# Altium project POC_Marvin.PrjPcb
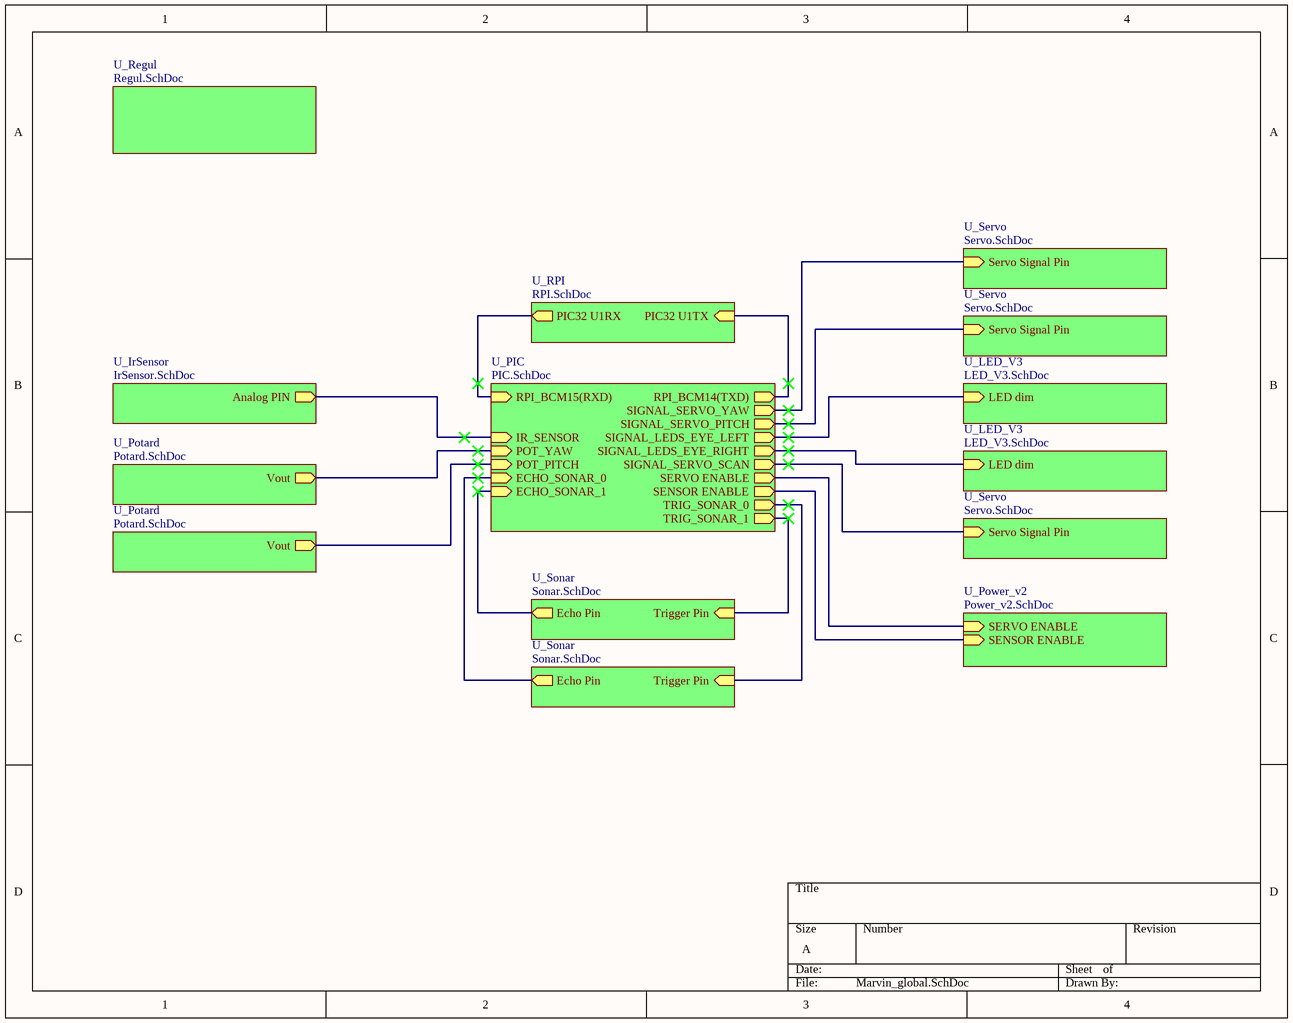
[diagram p0: Marvin_global.SchDoc]
10 sheets, 41 parts. Net scope: hierarchical (ports join the sheet entries above them; power ports are global).
Board files: Marvin_PCB.PcbDoc, Marvin_PCB_V2.PcbDoc, Marvin_PCB_v3.PcbDoc
Sheets:
  Marvin_global.SchDoc
    U_IrSensor = IrSensor.SchDoc
    U_LED_V3 = LED_V3.SchDoc
    U_LED_V3 = LED_V3.SchDoc
    U_Potard = Potard.SchDoc
    U_Potard = Potard.SchDoc
    U_Power_v2 = Power_v2.SchDoc
    U_Regul = Regul.SchDoc
    U_RPI = RPI.SchDoc
    U_Servo = Servo.SchDoc
    U_Sonar = Sonar.SchDoc
    U_Servo = Servo.SchDoc
    U_Servo = Servo.SchDoc
    U_Sonar = Sonar.SchDoc
    U_PIC = PIC.SchDoc

## Sheet Marvin_global.SchDoc
size A

### Sub-sheets
U_IrSensor = IrSensor.SchDoc: Analog PIN (out)
U_LED_V3 = LED_V3.SchDoc: LED dim (in)
U_LED_V3 = LED_V3.SchDoc: LED dim (in)
U_PIC = PIC.SchDoc: RPI_BCM15(RXD) (in), RPI_BCM14(TXD) (out), SIGNAL_SERVO_YAW (out), SIGNAL_SERVO_PITCH (out), SIGNAL_LEDS_EYE_LEFT (out), SIGNAL_LEDS_EYE_RIGHT (out), SIGNAL_SERVO_SCAN (out), TRIG_SONAR_0 (out), TRIG_SONAR_1 (out), ECHO_SONAR_0 (in), ECHO_SONAR_1 (in), IR_SENSOR (in), POT_YAW (in), POT_PITCH (in), SERVO ENABLE (out), SENSOR ENABLE (out)
U_Potard = Potard.SchDoc: Vout (out)
U_Potard = Potard.SchDoc: Vout (out)
U_Power_v2 = Power_v2.SchDoc: SERVO ENABLE (in), SENSOR ENABLE (in)
U_Regul = Regul.SchDoc: no entries
U_RPI = RPI.SchDoc: PIC32 U1TX (in), PIC32 U1RX (out)
U_Servo = Servo.SchDoc: Servo Signal Pin (in)
U_Servo = Servo.SchDoc: Servo Signal Pin (in)
U_Servo = Servo.SchDoc: Servo Signal Pin (in)
U_Sonar = Sonar.SchDoc: Trigger Pin (in), Echo Pin (out)
U_Sonar = Sonar.SchDoc: Trigger Pin (in), Echo Pin (out)

### Nets
NetJ1_3: sheet U_IrSensor/Analog PIN, sheet U_PIC/IR_SENSOR
NetJ2_U_Potard1_3: sheet U_Potard/Vout, sheet U_PIC/POT_PITCH
NetJ2_U_Potard2_3: sheet U_Potard/Vout, sheet U_PIC/POT_YAW
NetJ4_1: sheet U_RPI/PIC32 U1TX, sheet U_PIC/RPI_BCM14(TXD)
NetJ4_2: sheet U_RPI/PIC32 U1RX, sheet U_PIC/RPI_BCM15(RXD)
NetJ5_U_Servo1_3: sheet U_Servo/Servo Signal Pin, sheet U_PIC/SIGNAL_SERVO_SCAN
NetJ5_U_Servo2_3: sheet U_Servo/Servo Signal Pin, sheet U_PIC/SIGNAL_SERVO_PITCH
NetJ5_U_Servo3_3: sheet U_Servo/Servo Signal Pin, sheet U_PIC/SIGNAL_SERVO_YAW
NetJ6_U_Sonar1_2: sheet U_Sonar/Trigger Pin, sheet U_PIC/TRIG_SONAR_1
NetJ6_U_Sonar1_3: sheet U_Sonar/Echo Pin, sheet U_PIC/ECHO_SONAR_1
NetJ6_U_Sonar2_2: sheet U_Sonar/Trigger Pin, sheet U_PIC/TRIG_SONAR_0
NetJ6_U_Sonar2_3: sheet U_Sonar/Echo Pin, sheet U_PIC/ECHO_SONAR_0
NetJ7_U_LED_V31_3: sheet U_LED_V3/LED dim, sheet U_PIC/SIGNAL_LEDS_EYE_RIGHT
NetJ7_U_LED_V32_3: sheet U_LED_V3/LED dim, sheet U_PIC/SIGNAL_LEDS_EYE_LEFT
NetQ1_2: sheet U_Power_v2/SENSOR ENABLE, sheet U_PIC/SENSOR ENABLE
NetQ2_1: sheet U_Power_v2/SERVO ENABLE, sheet U_PIC/SERVO ENABLE

## Sheet IrSensor.SchDoc
size A4; Organization: Altium Limited; Address1: L3, 12a Rodborough Rd; Address2: Frenchs Forest; Address3: NSW; Address4: Australia 2086
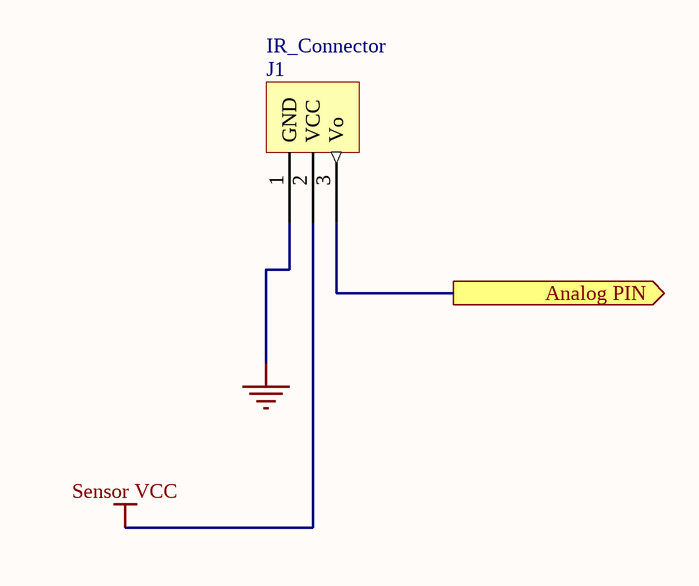
[diagram p1: IrSensor.SchDoc]

### Parts
J1  IR_Connector  [IR SENSOR CONNECTOR]

### Ports
Analog PIN (out)

### Nets
GND: J1.1(GND)
Sensor VCC: J1.2(VCC)
NetJ1_3: J1.3(Vo) ; port Analog PIN

### Notes on the sheet
- Title
- Size:
- Date:
- A4
- Number:
- Time:
- Revision:
- Sheet
- of
- File:

### Library data of the parts
J1 = IR_Connector: Female Embase 3 contacts; fournisseur: Farnell; reffournisseur: 1845931; fabricant: TE CONNECTIVITY / AMP; reffabricant: 5-534237-1

## Sheet LED_V3.SchDoc
size A
Used 2 times, as channels U_LED_V3, U_LED_V3. Parts and nets are listed once, with the designators drawn on the sheet.
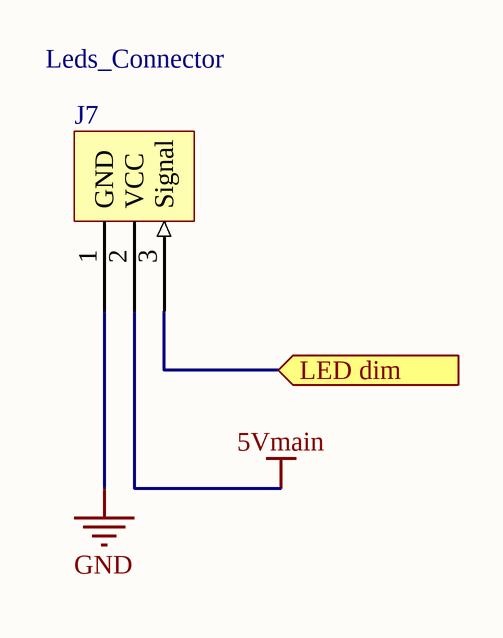
[diagram p2: LED_V3.SchDoc]

### Parts
J7  Leds_Connector  [LEDS CONNECTOR]

### Ports
LED dim (in)

### Nets
5Vmain: J7.2(VCC)
GND: J7.1(GND)
LED dim: J7.3(Signal) ; port LED dim

### Channels
U_LED_V3: designators end in _U_LED_V32; ports LED dim=NetJ7_U_LED_V32_3
U_LED_V3: designators end in _U_LED_V31; ports LED dim=NetJ7_U_LED_V31_3

### Library data of the parts
J7 = Leds_Connector: Female Embase 3 contacts; fournisseur: Farnell; reffournisseur: 1845931; fabricant: TE CONNECTIVITY / AMP; reffabricant: 5-534237-1

## Sheet Potard.SchDoc
size A
Used 2 times, as channels U_Potard, U_Potard. Parts and nets are listed once, with the designators drawn on the sheet.
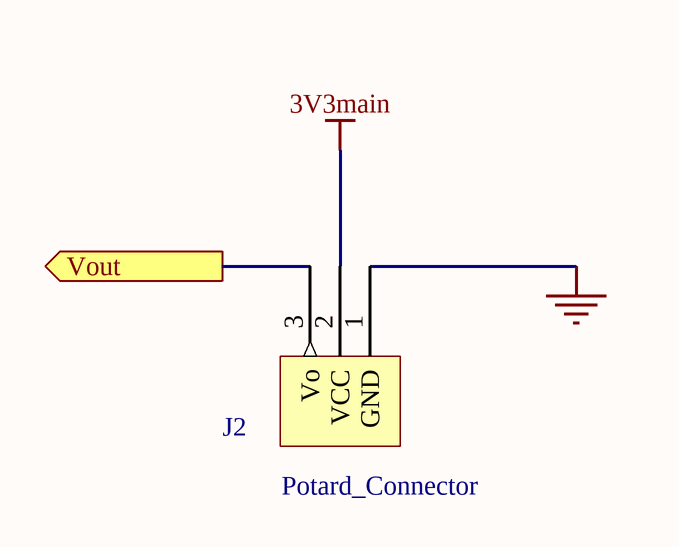
[diagram p3: Potard.SchDoc]

### Parts
J2  Potard_Connector  [POTARD CONNECTOR]

### Ports
Vout (out)

### Nets
3V3main: J2.2(VCC)
GND: J2.1(GND)
Vout: J2.3(Vo) ; port Vout

### Channels
U_Potard: designators end in _U_Potard2; ports Vout=NetJ2_U_Potard2_3
U_Potard: designators end in _U_Potard1; ports Vout=NetJ2_U_Potard1_3

### Library data of the parts
J2 = Potard_Connector: Female Embase 3 contacts; fournisseur: Farnell; reffournisseur: 1845931; fabricant: TE CONNECTIVITY / AMP; reffabricant: 5-534237-1

## Sheet Power_v2.SchDoc
size A
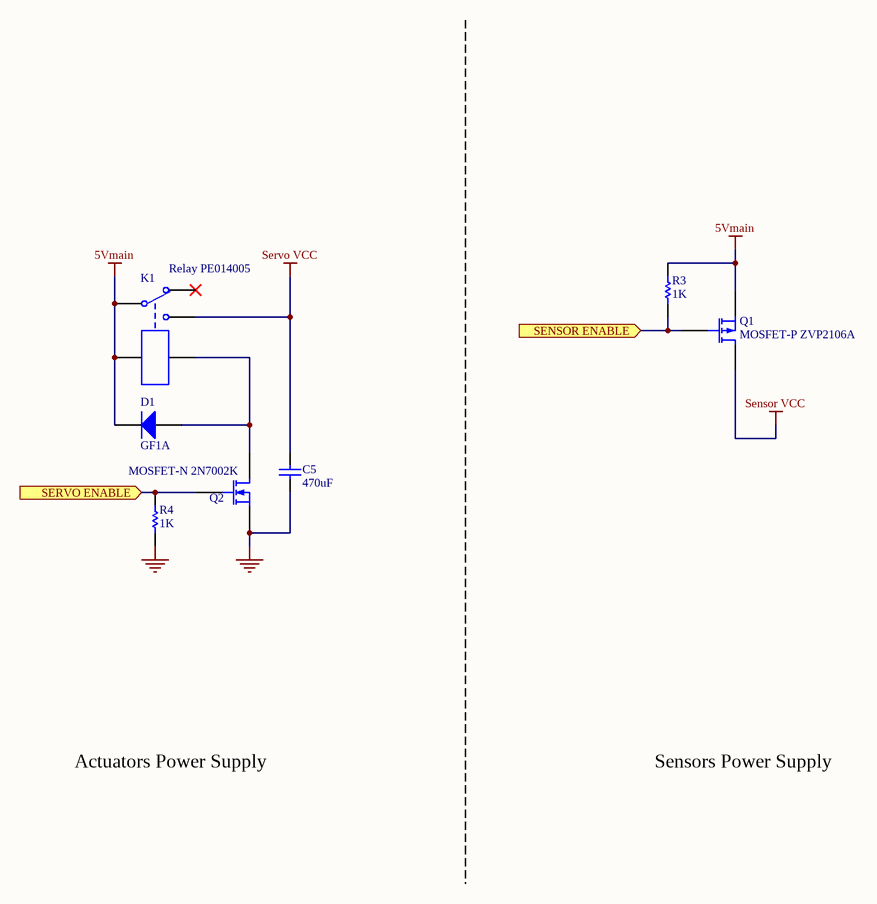
[diagram p4: Power_v2.SchDoc]

### Parts
C5  470uF  [CONDO_D_10mm]
D1  GF1A  [SMA/DO-214AC_21]
K1  Relay PE014005  [PE014005]
Q1  MOSFET-P ZVP2106A  [SOT23]
Q2  MOSFET-N 2N7002K  [SOT23]
R3  1K  [1608 / 0603]
R4  1K  [1608 / 0603]

### Ports
SENSOR ENABLE (in), SERVO ENABLE (in)

### Nets
5Vmain: D1.2(K) K1.12 K1.A2 Q1.3(S) R3.2
GND: C5.1 Q2.2(G) R4.1
Sensor VCC: Q1.1(D)
Servo VCC: C5.2 K1.11
NetD1_1: D1.1(A) K1.A1 Q2.3(S)
NetQ1_2: Q1.2(G) R3.1 ; port SENSOR ENABLE
NetQ2_1: Q2.1(D) R4.2 ; port SERVO ENABLE

Not connected (* = marked no-connect by the designer): K1 14*

### Notes on the sheet
- Actuators Power Supply
- Sensors Power Supply

### Library data of the parts
C5 = Cap: Capacitor; fabricant: Panasonic; fournisseur: Farnell; reffabricant: ECA-1EHG471; reffournisseur: 9692843; Published: 8-Jun-2000; LatestRevisionDate: 17-Jul-2002; LatestRevisionNote: Re-released for DXP Platform.; PackageReference: RAD-0.3; Publisher: Altium Limited; PackageDescription: Radial Cap, Thru-Hole; 2 Leads; 0.3 in Pin Spacing
D1 = Diode: Default Diode; fournisseur: Farnell; reffournisseur: 9549560; fabricant: VISHAY; reffabricant: GF1A-E3/67A; Published: 8-Jun-2000; LatestRevisionDate: 17-Jul-2002; LatestRevisionNote: Re-released for DXP Platform.; PackageVersion: Sep-1996; PackageReference: SMC; Publisher: Altium Limited; PackageDescription: DO-214-AB/SMC; 2 C-Bend Leads; Body 7.9 x 5.9 mm, inc. leads (LxW); Code_JEDEC: DO-214-AB
K1 = Relay-SPDT: Relay; fournisseur: Farnell; reffournisseur: 1175088; fabricant: TE CONNECTIVITY / SCHRACK; Published: 24-Mar-1999; LatestRevisionDate: 17-Jul-2002; LatestRevisionNote: Re-released for DXP Platform.; PackageReference: MODULE5B; Publisher: Altium Limited; reffabricant: PE014005
Q1 = MOSFET-P: P-Channel MOSFET; fournisseur: Farnell; reffournisseur: 9525505; fabricant: DIODES INC; Published: 8-Jun-2000; LatestRevisionDate: 17-Jul-2002; LatestRevisionNote: Re-released for DXP Platform.; PackageVersion: 1995/1996; PackageReference: E3; Publisher: Altium Limited; PackageDescription: TO, Flat Index; 3 In-Line, Axial Leads; Body Dia. 4.6mm; Lead Dia. 0.5 mm (max); reffabricant: ZVP2106A
Q2 = MOSFET-N: N-Channel MOSFET; fournisseur: Farnell; reffournisseur: 2453382; fabricant: FAIRCHILD SEMICONDUCTOR; Published: 8-Jun-2000; LatestRevisionDate: 17-Jul-2002; LatestRevisionNote: Re-released for DXP Platform.; PackageVersion: 1995/1996; PackageReference: E3; Publisher: Altium Limited; PackageDescription: TO, Flat Index; 3 In-Line, Axial Leads; Body Dia. 4.6mm; Lead Dia. 0.5 mm (max); reffabricant: 2N7002K
R3 R4 = Res1: Resistor; Published: 8-Jun-2000; LatestRevisionDate: 17-Jul-2002; LatestRevisionNote: Re-released for DXP Platform.; PackageReference: AXIAL-0.3; Publisher: Altium Limited; PackageDescription: Axial Device, Thru-Hole; 2 Leads; 0.3 in Pin Spacing; Value: 1K

## Sheet Regul.SchDoc
size A
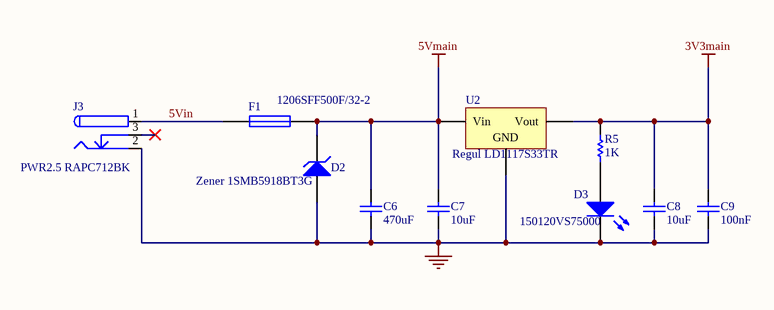
[diagram p5: Regul.SchDoc]

### Parts
C6  470uF  [CONDO_D_10mm]
C7  10uF  [CONDO_D_5MM]
C8  10uF  [CONDO_D_5MM]
C9  100nF  [1608 / 0603]
D2  Zener 1SMB5918BT3G  [DIODE ZENER]
D3  150120VS75000  [3216 / 1206]
F1  1206SFF500F/32-2  [3216 / 1206]
J3  PWR2.5 RAPC712BK  [RAPC712BK]
R5  1K  [1608 / 0603]
U2  Regul LD1117S33TR  [SOT-223]

### Nets
3V3main: C8.2 C9.2 R5.2 U2.3(Vout)
5Vmain: C6.2 C7.2 D2.2(K) F1.2 U2.1(Vin)
GND: C6.1 C7.1 C8.1 C9.1 D2.1(A) D3.2(K) J3.2 U2.2(GND)
5Vin: F1.1 J3.1
NetD3_1: D3.1(A) R5.1

Not connected (* = marked no-connect by the designer): J3 3*

### Library data of the parts
C6 = Cap: Capacitor; Value: ECA-1EHG471; fabricant: Panasonic; fournisseur: Farnell; reffournisseur: 9692843; Published: 8-Jun-2000; LatestRevisionDate: 17-Jul-2002; LatestRevisionNote: Re-released for DXP Platform.; PackageReference: RAD-0.3; Publisher: Altium Limited; PackageDescription: Radial Cap, Thru-Hole; 2 Leads; 0.3 in Pin Spacing
C7 C8 = Cap: Capacitor; Value: 100pF; fabricant: Panasonic; fournisseur: Farnell; reffabricant: ECA-1JHG100; reffournisseur: 1848557; Published: 8-Jun-2000; LatestRevisionDate: 17-Jul-2002; LatestRevisionNote: Re-released for DXP Platform.; PackageReference: RAD-0.3; Publisher: Altium Limited; PackageDescription: Radial Cap, Thru-Hole; 2 Leads; 0.3 in Pin Spacing
C9 = Cap: Capacitor; Published: 8-Jun-2000; LatestRevisionDate: 17-Jul-2002; LatestRevisionNote: Re-released for DXP Platform.; PackageReference: RAD-0.3; Publisher: Altium Limited; PackageDescription: Radial Cap, Thru-Hole; 2 Leads; 0.3 in Pin Spacing; Value: 100nF
D2 = D Zener: Zener Diode; fournisseur: Farnell; reffournisseur: 1431161; fabricant: ON SEMICONDUCTORS; Published: 8-Jun-2000; LatestRevisionDate: 17-Jul-2002; LatestRevisionNote: Re-released for DXP Platform.; PackageReference: DIODE-0.7; Publisher: Altium Limited; PackageDescription: Diode, Thru-Hole; 2 Leads; 0.7 in Pin Spacing; reffabricant: 1SMB5918BT3G
D3 = LED0: Green LED; fournisseur: Farnell; reffournisseur: 2322088; fabricant: WURTH ELEKTRONIK; Published: 8-Jun-2000; LatestRevisionDate: 08-Jul-2005; LatestRevisionNote: Mech Layer 1 removed.; PackageReference: LED-0; Publisher: Altium Limited; PackageDescription: LED; 2 Leads; reffabricant: 150120VS75000
F1 = Fuse 1: Fuse; fournisseur: Farnell; reffournisseur: 1843811; fabricant: TE CONNECTIVITY / RAYCHEM; Published: 8-Jun-2000; LatestRevisionDate: 17-Jul-2002; LatestRevisionNote: Re-released for DXP Platform.; PackageReference: PIN-W2/E2.8; Publisher: Altium Limited; PackageDescription: Thru-Hole; 2 Leads; reffabricant: 1206SFF500F/32-2
J3 = PWR2.5: Jack Connector; fournisseur: Farnell; reffournisseur: 1617204; fabricant: SWITCHCRAFT; Published: 17-Dec-2003; DatasheetDocument: 09-May-2002; Publisher: Altium Limited; ComponentLink1Description: Manufacturer Link; ComponentLink1URL: http://domino.kycon.com/internet/Products.html; reffabricant: RAPC712BK
R5 = Res1: Resistor; Published: 8-Jun-2000; LatestRevisionDate: 17-Jul-2002; LatestRevisionNote: Re-released for DXP Platform.; PackageReference: AXIAL-0.3; Publisher: Altium Limited; PackageDescription: Axial Device, Thru-Hole; 2 Leads; 0.3 in Pin Spacing; Value: 1K
U2 = Volt Reg: Voltage Regulator; fournisseur: Farnell; reffournisseur: 1202826; fabricant: ST MICRO; Published: 24-Mar-1999; LatestRevisionDate: 29-May-2009; LatestRevisionNote: IPC-7351 Footprint Added.; PackageReference: D2PAK; Publisher: Altium Limited; PackageDescription: 3-Pin Transistor Outline Package 2.54 mm Pitch, 15.1 mm Lead Span; reffabricant: LD1117S33TR

## Sheet RPI.SchDoc
size A
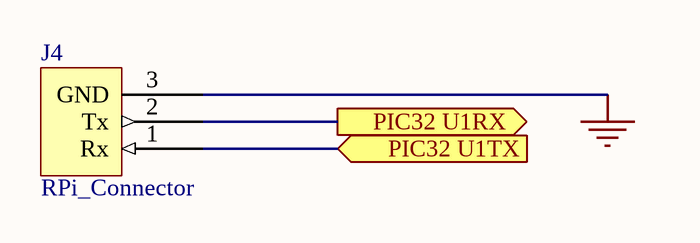
[diagram p6: RPI.SchDoc]

### Parts
J4  RPi_Connector  [RPI CONNECTOR]

### Ports
PIC32 U1RX (out), PIC32 U1TX (in)

### Nets
GND: J4.3(GND)
NetJ4_1: J4.1(Rx) ; port PIC32 U1TX
NetJ4_2: J4.2(Tx) ; port PIC32 U1RX

### Library data of the parts
J4 = RPi_Connector: Female Embase 3 contacts; fournisseur: Farnell; reffournisseur: 1845931; fabricant: TE CONNECTIVITY / AMP; reffabricant: 5-534237-1

## Sheet Servo.SchDoc
size A
Used 3 times, as channels U_Servo, U_Servo, U_Servo. Parts and nets are listed once, with the designators drawn on the sheet.
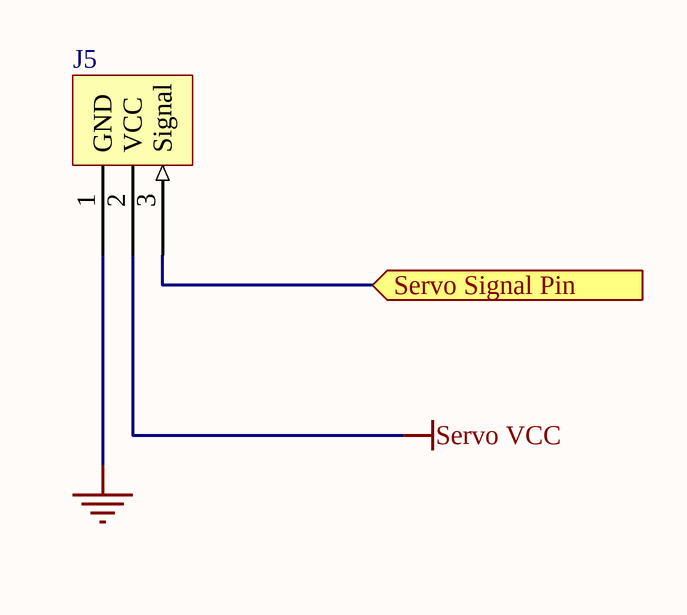
[diagram p7: Servo.SchDoc]

### Parts
J5  Servo_Connector  [SERVO CONNECTOR]  (value not drawn)

### Ports
Servo Signal Pin (in)

### Nets
GND: J5.1(GND)
Servo VCC: J5.2(VCC)
Servo Signal Pin: J5.3(Signal) ; port Servo Signal Pin

### Channels
U_Servo: designators end in _U_Servo3; ports Servo Signal Pin=NetJ5_U_Servo3_3
U_Servo: designators end in _U_Servo2; ports Servo Signal Pin=NetJ5_U_Servo2_3
U_Servo: designators end in _U_Servo1; ports Servo Signal Pin=NetJ5_U_Servo1_3

### Library data of the parts
J5 = Servo_Connector: Female Embase 3 contacts; fournisseur: Farnell; reffournisseur: 1845931; fabricant: TE CONNECTIVITY / AMP; reffabricant: 5-534237-1

## Sheet Sonar.SchDoc
size A
Used 2 times, as channels U_Sonar, U_Sonar. Parts and nets are listed once, with the designators drawn on the sheet.
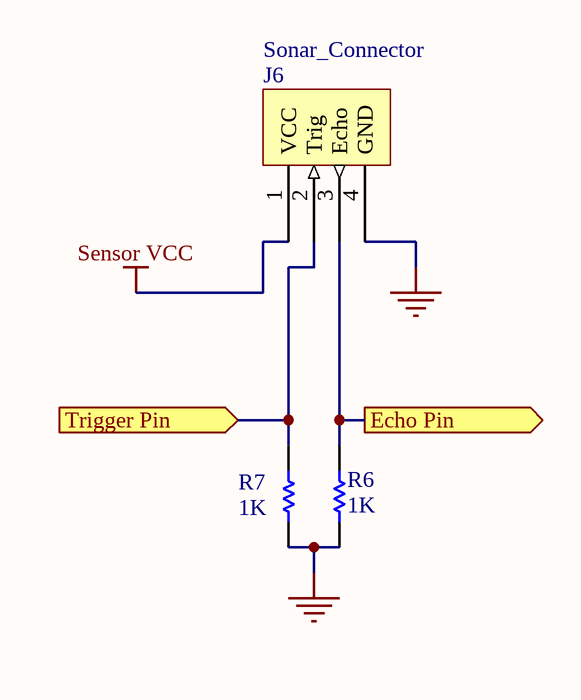
[diagram p8: Sonar.SchDoc]

### Parts
J6  Sonar_Connector  [SONAR CONNECTOR]
R6  1K  [1608 / 0603]
R7  1K  [1608 / 0603]

### Ports
Echo Pin (out), Trigger Pin (in)

### Nets
GND: J6.4(GND) R6.1 R7.1
Sensor VCC: J6.1(VCC)
Echo Pin: J6.3(Echo) R6.2 ; port Echo Pin
Trigger Pin: J6.2(Trig) R7.2 ; port Trigger Pin

### Channels
U_Sonar: designators end in _U_Sonar2; ports Echo Pin=NetJ6_U_Sonar2_3 Trigger Pin=NetJ6_U_Sonar2_2
U_Sonar: designators end in _U_Sonar1; ports Echo Pin=NetJ6_U_Sonar1_3 Trigger Pin=NetJ6_U_Sonar1_2

### Library data of the parts
J6 = Sonar_Connector: Female Embase 4 contacts; fournisseur: Farnell; reffournisseur: 1845959; fabricant: TE CONNECTIVITY / AMP; reffabricant: 5-534237-2
R6 R7 = Res1: Resistor; Published: 8-Jun-2000; LatestRevisionDate: 17-Jul-2002; LatestRevisionNote: Re-released for DXP Platform.; PackageReference: AXIAL-0.3; Publisher: Altium Limited; PackageDescription: Axial Device, Thru-Hole; 2 Leads; 0.3 in Pin Spacing; Value: 1K

## Sheet PIC.SchDoc
size A
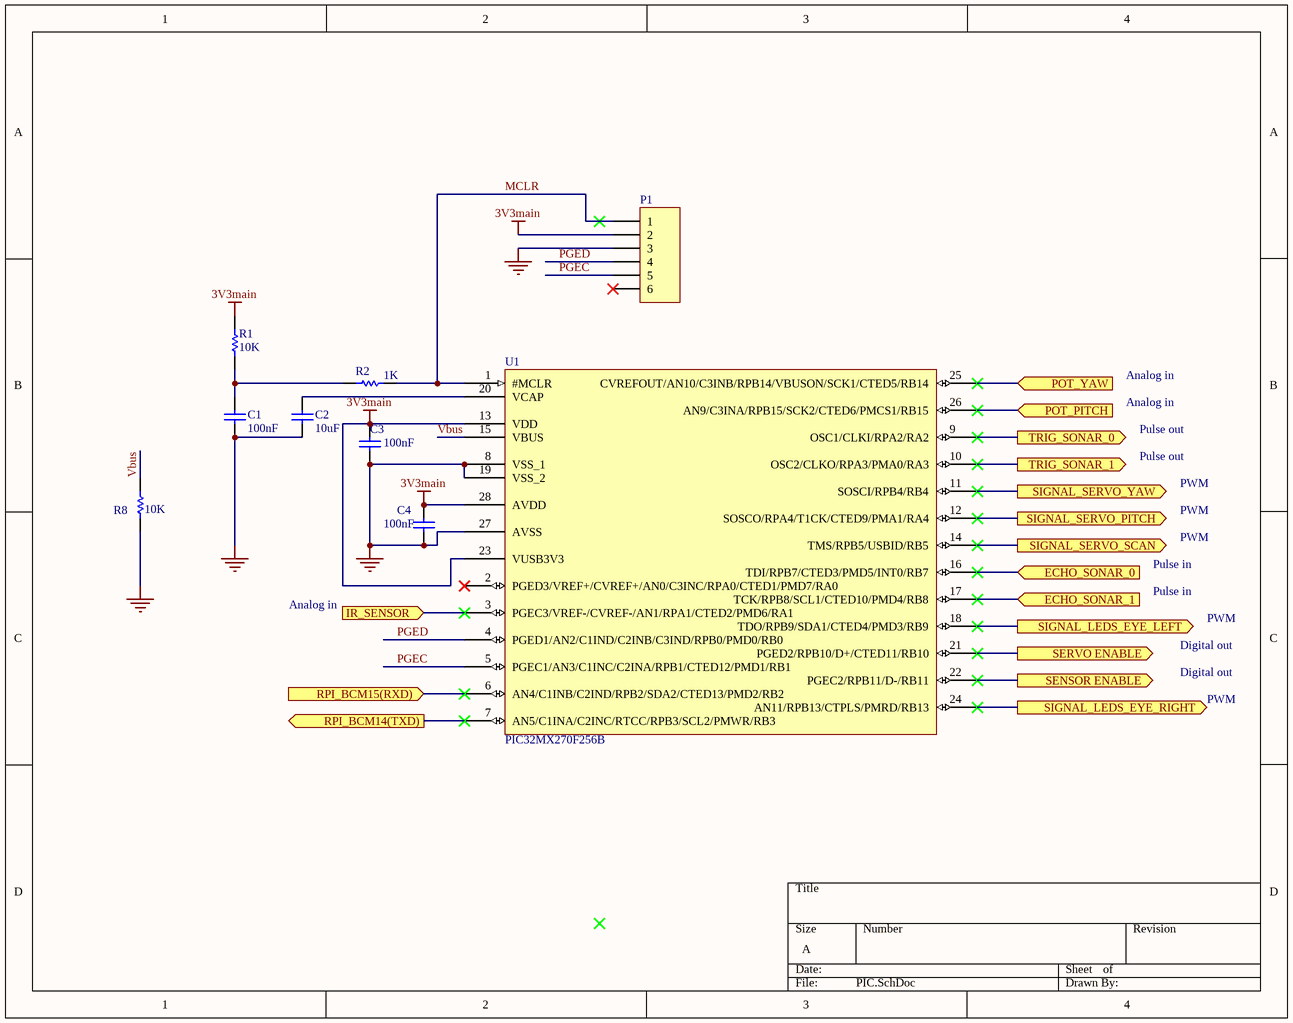
[diagram p9: PIC.SchDoc]

### Parts
C1  100nF  [1608 / 0603]
C2  10uF  [1608 / 0603]
C3  100nF  [1608 / 0603]
C4  100nF  [1608 / 0603]
P1  RJ11 Debug  [RJ11]  (value not drawn)
R1  10K  [1608 / 0603]
R2  1K  [1608 / 0603]
R8  10K  [1608 / 0603]
U1  PIC32MX270F256B  [SOIC28]

### Ports
ECHO_SONAR_0 (in), ECHO_SONAR_1 (in), IR_SENSOR (in), POT_PITCH (in), POT_YAW (in), RPI_BCM14(TXD) (out), RPI_BCM15(RXD) (in), SENSOR ENABLE (out), SERVO ENABLE (out), SIGNAL_LEDS_EYE_LEFT (out), SIGNAL_LEDS_EYE_RIGHT (out), SIGNAL_SERVO_PITCH (out), SIGNAL_SERVO_SCAN (out), SIGNAL_SERVO_YAW (out), TRIG_SONAR_0 (out), TRIG_SONAR_1 (out)

### Nets
3V3main: C3.2 C4.2 P1.2 R1.2 U1.13(VDD) U1.23(VUSB3V3) U1.28(AVDD)
GND: C1.1 C2.1 C3.1 C4.1 P1.3 R8.1 U1.8(VSS_1) U1.19(VSS_2) U1.27(AVSS)
MCLR: P1.1 R2.2 U1.1(#MCLR)
PGEC: P1.5 U1.5(PGEC1/AN3/C1INC/C2INA/RPB1/CTED12/PMD1/RB1)
PGED: P1.4 U1.4(PGED1/AN2/C1IND/C2INB/C3IND/RPB0/PMD0/RB0)
Vbus: R8.2 U1.15(VBUS)
NetC1_2: C1.2 R1.1 R2.1
NetC2_2: C2.2 U1.20(VCAP)
NetJ1_3: U1.3(PGEC3/VREF-/CVREF-/AN1/RPA1/CTED2/PMD6/RA1) ; port IR_SENSOR
NetJ2_U_Potard1_3: U1.26(AN9/C3INA/RPB15/SCK2/CTED6/PMCS1/RB15) ; port POT_PITCH
NetJ2_U_Potard2_3: U1.25(CVREFOUT/AN10/C3INB/RPB14/VBUSON/SCK1/CTED5/RB14) ; port POT_YAW
NetJ4_1: U1.7(AN5/C1INA/C2INC/RTCC/RPB3/SCL2/PMWR/RB3) ; port RPI_BCM14(TXD)
NetJ4_2: U1.6(AN4/C1INB/C2IND/RPB2/SDA2/CTED13/PMD2/RB2) ; port RPI_BCM15(RXD)
NetJ5_U_Servo1_3: U1.14(TMS/RPB5/USBID/RB5) ; port SIGNAL_SERVO_SCAN
NetJ5_U_Servo2_3: U1.12(SOSCO/RPA4/T1CK/CTED9/PMA1/RA4) ; port SIGNAL_SERVO_PITCH
NetJ5_U_Servo3_3: U1.11(SOSCI/RPB4/RB4) ; port SIGNAL_SERVO_YAW
NetJ6_U_Sonar1_2: U1.10(OSC2/CLKO/RPA3/PMA0/RA3) ; port TRIG_SONAR_1
NetJ6_U_Sonar1_3: U1.17(TCK/RPB8/SCL1/CTED10/PMD4/RB8) ; port ECHO_SONAR_1
NetJ6_U_Sonar2_2: U1.9(OSC1/CLKI/RPA2/RA2) ; port TRIG_SONAR_0
NetJ6_U_Sonar2_3: U1.16(TDI/RPB7/CTED3/PMD5/INT0/RB7) ; port ECHO_SONAR_0
NetJ7_U_LED_V31_3: U1.24(AN11/RPB13/CTPLS/PMRD/RB13) ; port SIGNAL_LEDS_EYE_RIGHT
NetJ7_U_LED_V32_3: U1.18(TDO/RPB9/SDA1/CTED4/PMD3/RB9) ; port SIGNAL_LEDS_EYE_LEFT
NetQ1_2: U1.22(PGEC2/RPB11/D-/RB11) ; port SENSOR ENABLE
NetQ2_1: U1.21(PGED2/RPB10/D+/CTED11/RB10) ; port SERVO ENABLE

Not connected (* = marked no-connect by the designer): P1 6*; U1 2(PGED3/VREF+/CVREF+/AN0/C3INC/RPA0/CTED1/PMD7/RA0)*

### Notes on the sheet
- Analog in
- Pulse out
- PWM
- Pulse in
- Digital out

### Library data of the parts
C1-C4 = Cap: Capacitor; Value: 100pF; Published: 8-Jun-2000; LatestRevisionDate: 17-Jul-2002; LatestRevisionNote: Re-released for DXP Platform.; PackageReference: RAD-0.3; Publisher: Altium Limited; PackageDescription: Radial Cap, Thru-Hole; 2 Leads; 0.3 in Pin Spacing
P1 = Header 6: RJ11 Connector; fabricant: MOLEX; fournisseur: Farnell; reffabricant: 95009-7661; reffournisseur: 2076092; LatestRevisionDate: 17-Jul-2002; LatestRevisionNote: Re-released for DXP Platform.; Publisher: Altium Limited
R1 R8 = Res1: Resistor; Value: 1K; Published: 8-Jun-2000; LatestRevisionDate: 17-Jul-2002; LatestRevisionNote: Re-released for DXP Platform.; PackageReference: AXIAL-0.3; Publisher: Altium Limited; PackageDescription: Axial Device, Thru-Hole; 2 Leads; 0.3 in Pin Spacing
R2 = Res1: Resistor; Published: 8-Jun-2000; LatestRevisionDate: 17-Jul-2002; LatestRevisionNote: Re-released for DXP Platform.; PackageReference: AXIAL-0.3; Publisher: Altium Limited; PackageDescription: Axial Device, Thru-Hole; 2 Leads; 0.3 in Pin Spacing; Value: 1K
U1 = PIC32MX270F256B: fournisseur: Farnell; reffournisseur: 2419680; fabricant: Microchip; reffabricant: PIC32MX270F256B-50I/SO

## Nets that join several sheets
3V3main: U_Potard (J2_U_Potard2.2), U_Potard (J2_U_Potard1.2), Regul (C8.2 C9.2 R5.2 U2.3), PIC (7 pins)
5Vmain: U_LED_V3 (J7_U_LED_V32.2), U_LED_V3 (J7_U_LED_V31.2), Power_v2 (5 pins), Regul (5 pins)
GND: IrSensor (J1.1), U_LED_V3 (J7_U_LED_V32.1), U_LED_V3 (J7_U_LED_V31.1), U_Potard (J2_U_Potard2.1), U_Potard (J2_U_Potard1.1), Power_v2 (C5.1 Q2.2 R4.1), Regul (8 pins), RPI (J4.3), U_Servo (J5_U_Servo3.1), U_Sonar (J6_U_Sonar2.4 R6_U_Sonar2.1 R7_U_Sonar2.1), U_Servo (J5_U_Servo2.1), U_Servo (J5_U_Servo1.1), U_Sonar (J6_U_Sonar1.4 R6_U_Sonar1.1 R7_U_Sonar1.1), PIC (9 pins)
Sensor VCC: IrSensor (J1.2), Power_v2 (Q1.1), U_Sonar (J6_U_Sonar2.1), U_Sonar (J6_U_Sonar1.1)
Servo VCC: Power_v2 (C5.2 K1.11), U_Servo (J5_U_Servo3.2), U_Servo (J5_U_Servo2.2), U_Servo (J5_U_Servo1.2)
NetJ1_3: IrSensor (J1.3), PIC (U1.3)
NetJ2_U_Potard1_3: U_Potard (J2_U_Potard1.3), PIC (U1.26)
NetJ2_U_Potard2_3: U_Potard (J2_U_Potard2.3), PIC (U1.25)
NetJ4_1: RPI (J4.1), PIC (U1.7)
NetJ4_2: RPI (J4.2), PIC (U1.6)
NetJ5_U_Servo1_3: U_Servo (J5_U_Servo1.3), PIC (U1.14)
NetJ5_U_Servo2_3: U_Servo (J5_U_Servo2.3), PIC (U1.12)
NetJ5_U_Servo3_3: U_Servo (J5_U_Servo3.3), PIC (U1.11)
NetJ6_U_Sonar1_2: U_Sonar (J6_U_Sonar1.2 R7_U_Sonar1.2), PIC (U1.10)
NetJ6_U_Sonar1_3: U_Sonar (J6_U_Sonar1.3 R6_U_Sonar1.2), PIC (U1.17)
NetJ6_U_Sonar2_2: U_Sonar (J6_U_Sonar2.2 R7_U_Sonar2.2), PIC (U1.9)
NetJ6_U_Sonar2_3: U_Sonar (J6_U_Sonar2.3 R6_U_Sonar2.2), PIC (U1.16)
NetJ7_U_LED_V31_3: U_LED_V3 (J7_U_LED_V31.3), PIC (U1.24)
NetJ7_U_LED_V32_3: U_LED_V3 (J7_U_LED_V32.3), PIC (U1.18)
NetQ1_2: Power_v2 (Q1.2 R3.1), PIC (U1.22)
NetQ2_1: Power_v2 (Q2.1 R4.2), PIC (U1.21)